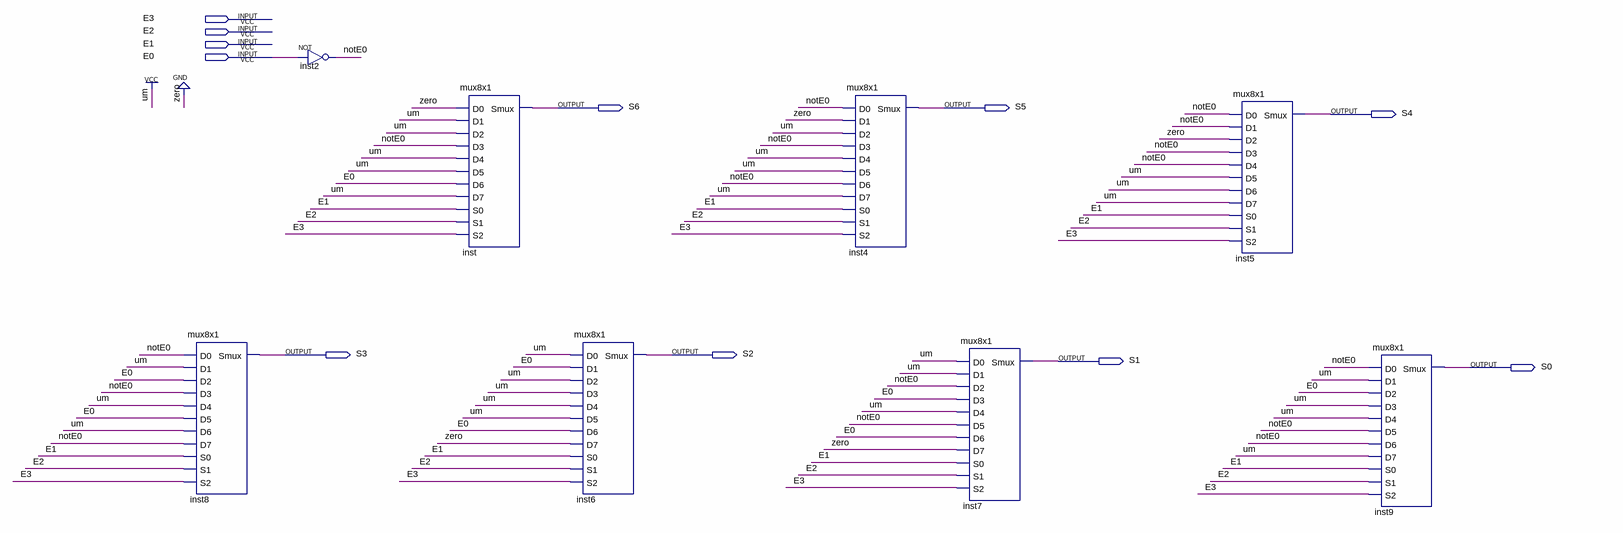
[diagram p0: schematic sheet]
// Quartus schematic display.bdf as structural Verilog: 8 symbols, 11 pins
module display (
  input  E3,
  input  E2,
  input  E1,
  input  E0,
  output S6,
  output S5,
  output S4,
  output S3,
  output S2,
  output S1,
  output S0
);

  wire notE0;

  mux8x1 inst8 (
    .D0(notE0), .D1(1'b1), .D2(E0), .D3(notE0), .D4(1'b1), .D5(E0), .D6(1'b1), .D7(notE0), .S0(E1), .S1(E2),
    .S2(E3), .Smux(S3));
  not inst2 (notE0, E0);
  mux8x1 inst (
    .D0(1'b0), .D1(1'b1), .D2(1'b1), .D3(notE0), .D4(1'b1), .D5(1'b1), .D6(E0), .D7(1'b1), .S0(E1), .S1(E2),
    .S2(E3), .Smux(S6));
  mux8x1 inst6 (
    .D0(1'b1), .D1(E0), .D2(1'b1), .D3(1'b1), .D4(1'b1), .D5(1'b1), .D6(E0), .D7(1'b0), .S0(E1), .S1(E2),
    .S2(E3), .Smux(S2));
  mux8x1 inst4 (
    .D0(notE0), .D1(1'b0), .D2(1'b1), .D3(notE0), .D4(1'b1), .D5(1'b1), .D6(notE0), .D7(1'b1), .S0(E1),
    .S1(E2), .S2(E3), .Smux(S5));
  mux8x1 inst7 (
    .D0(1'b1), .D1(1'b1), .D2(notE0), .D3(E0), .D4(1'b1), .D5(notE0), .D6(E0), .D7(1'b0), .S0(E1), .S1(E2),
    .S2(E3), .Smux(S1));
  mux8x1 inst5 (
    .D0(notE0), .D1(notE0), .D2(1'b0), .D3(notE0), .D4(notE0), .D5(1'b1), .D6(1'b1), .D7(1'b1), .S0(E1),
    .S1(E2), .S2(E3), .Smux(S4));
  mux8x1 inst9 (
    .D0(notE0), .D1(1'b1), .D2(E0), .D3(1'b1), .D4(1'b1), .D5(notE0), .D6(notE0), .D7(1'b1), .S0(E1),
    .S1(E2), .S2(E3), .Smux(S0));
endmodule
